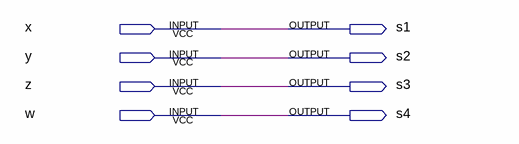
[diagram p0: schematic sheet]
// Quartus schematic rotate4.bdf as structural Verilog: 0 symbols, 8 pins
module rotate4 (
  input  x,
  input  y,
  input  z,
  input  w,
  output s1,
  output s2,
  output s3,
  output s4
);


  assign s1 = x;
  assign s2 = y;
  assign s3 = z;
  assign s4 = w;
endmodule
